# Altium schematic sheet Pipa PRD.SchDoc
size 840 x 594 mm; SheetNumber: 1; SheetTotal: 1
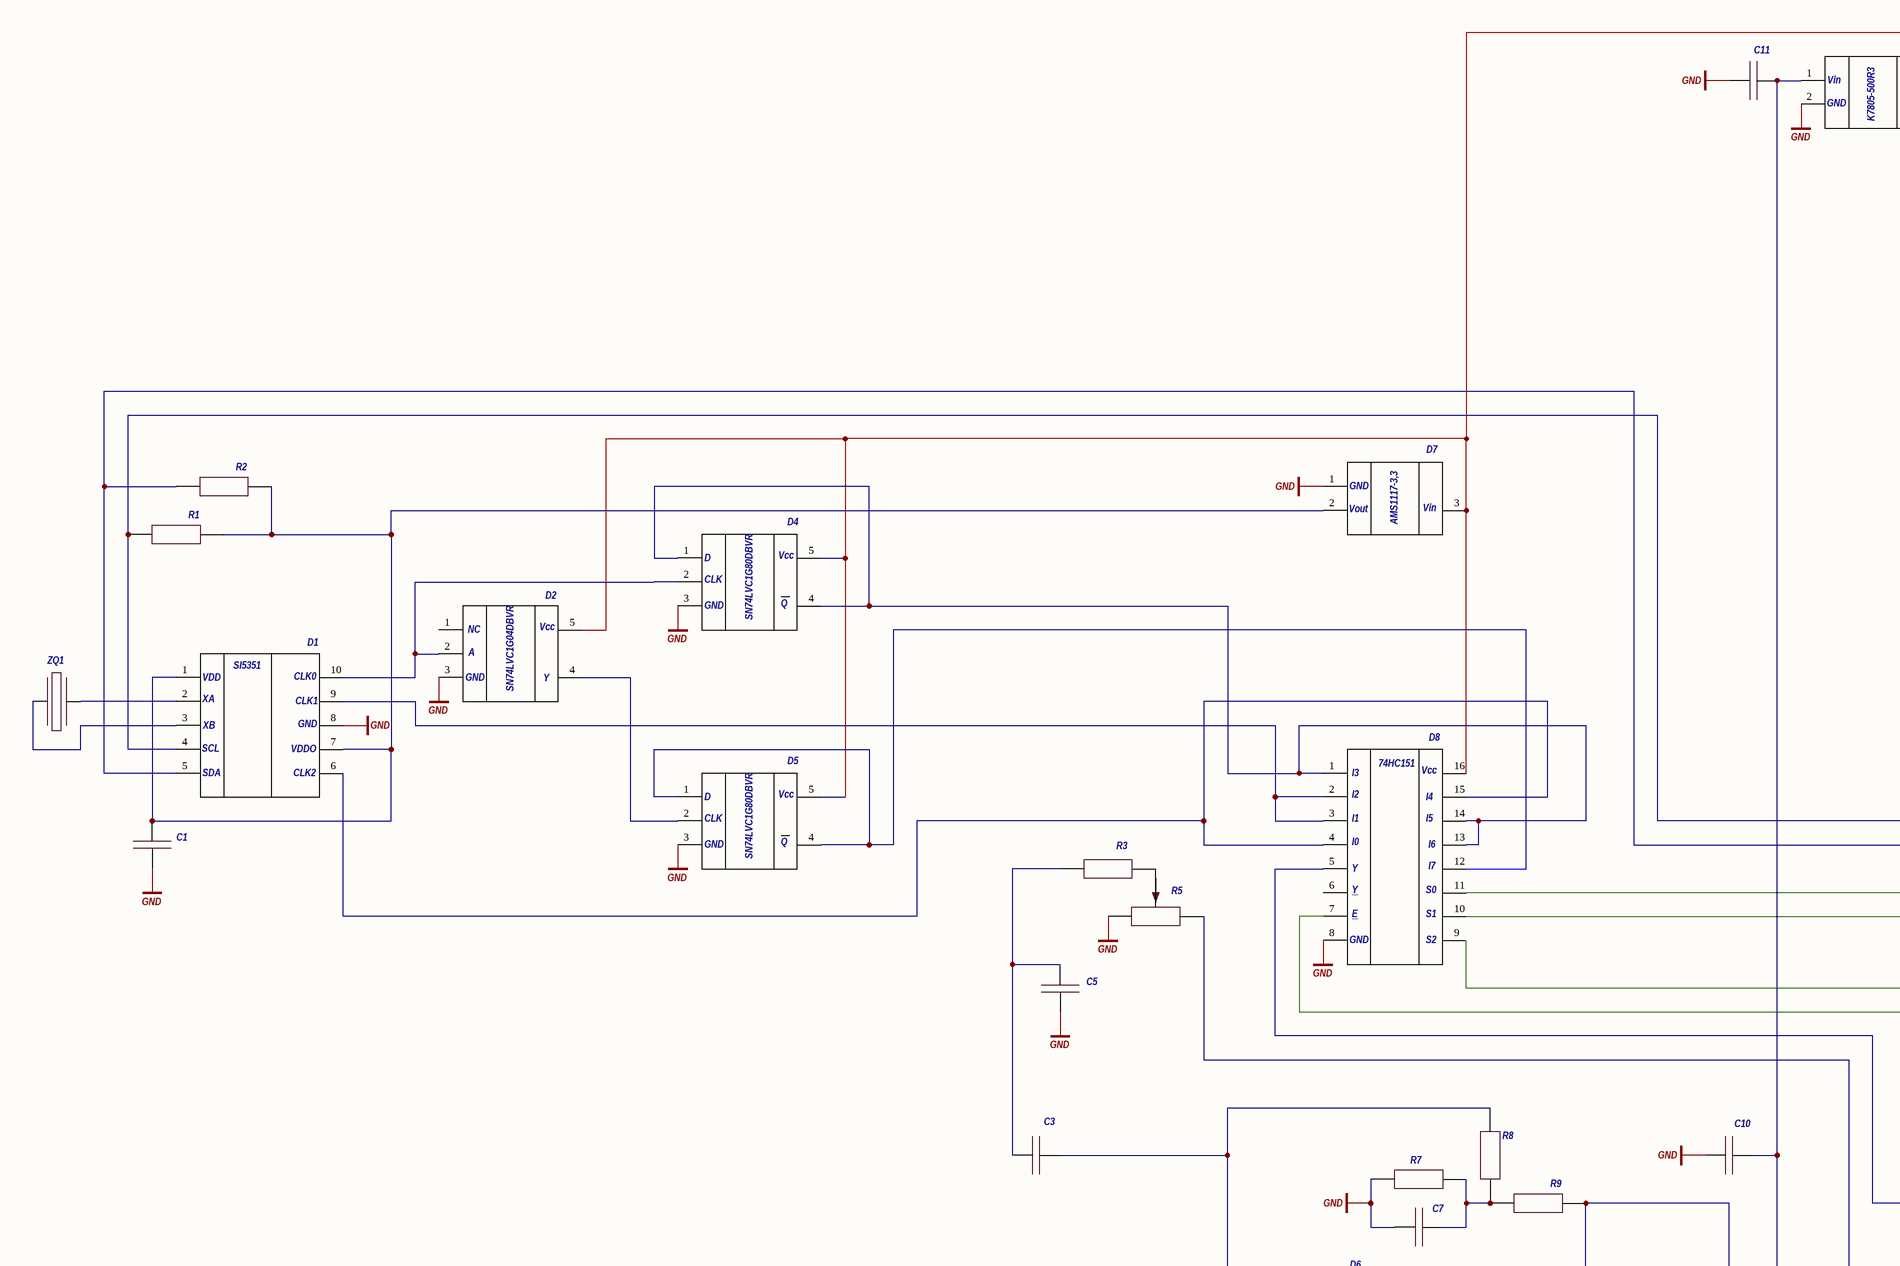
[diagram p0: Pipa PRD.SchDoc, top left]
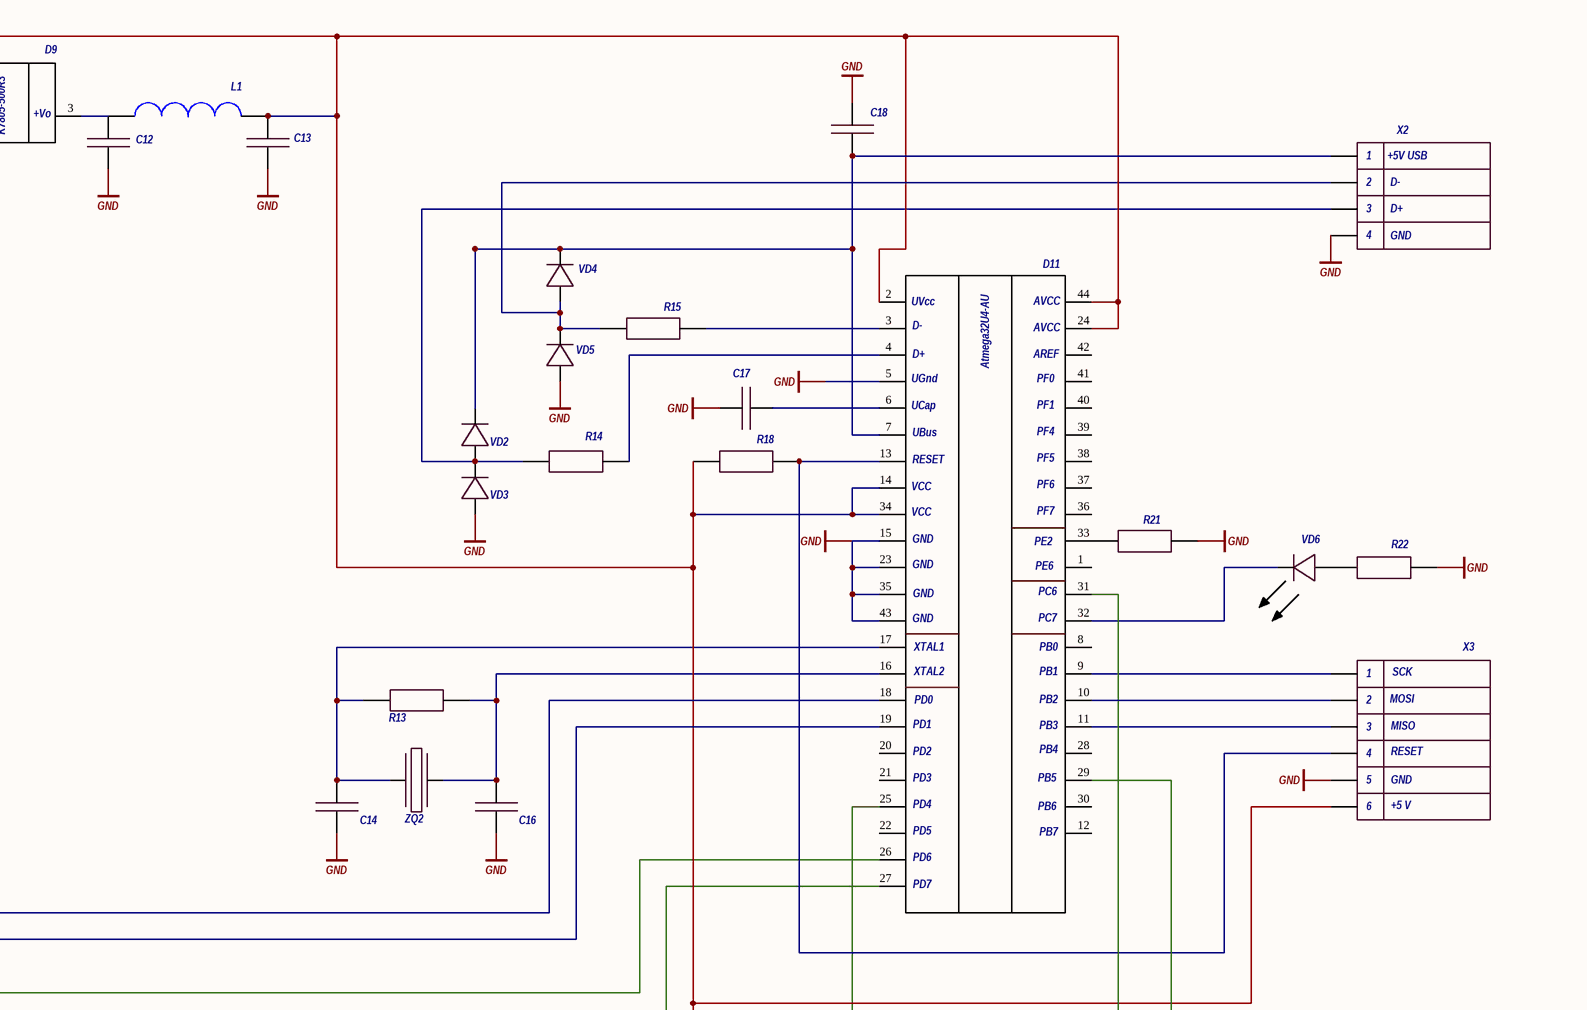
[diagram p1: Pipa PRD.SchDoc, top right]
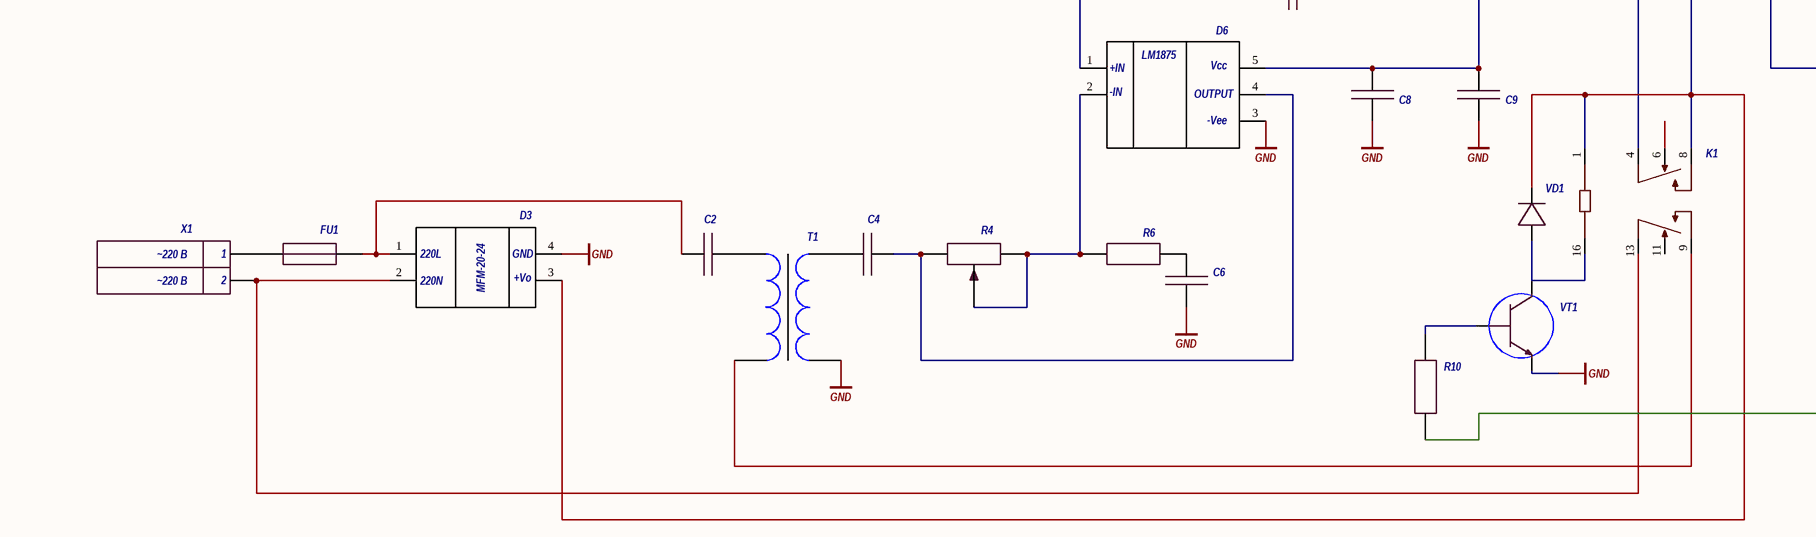
[diagram p2: Pipa PRD.SchDoc, bottom left]
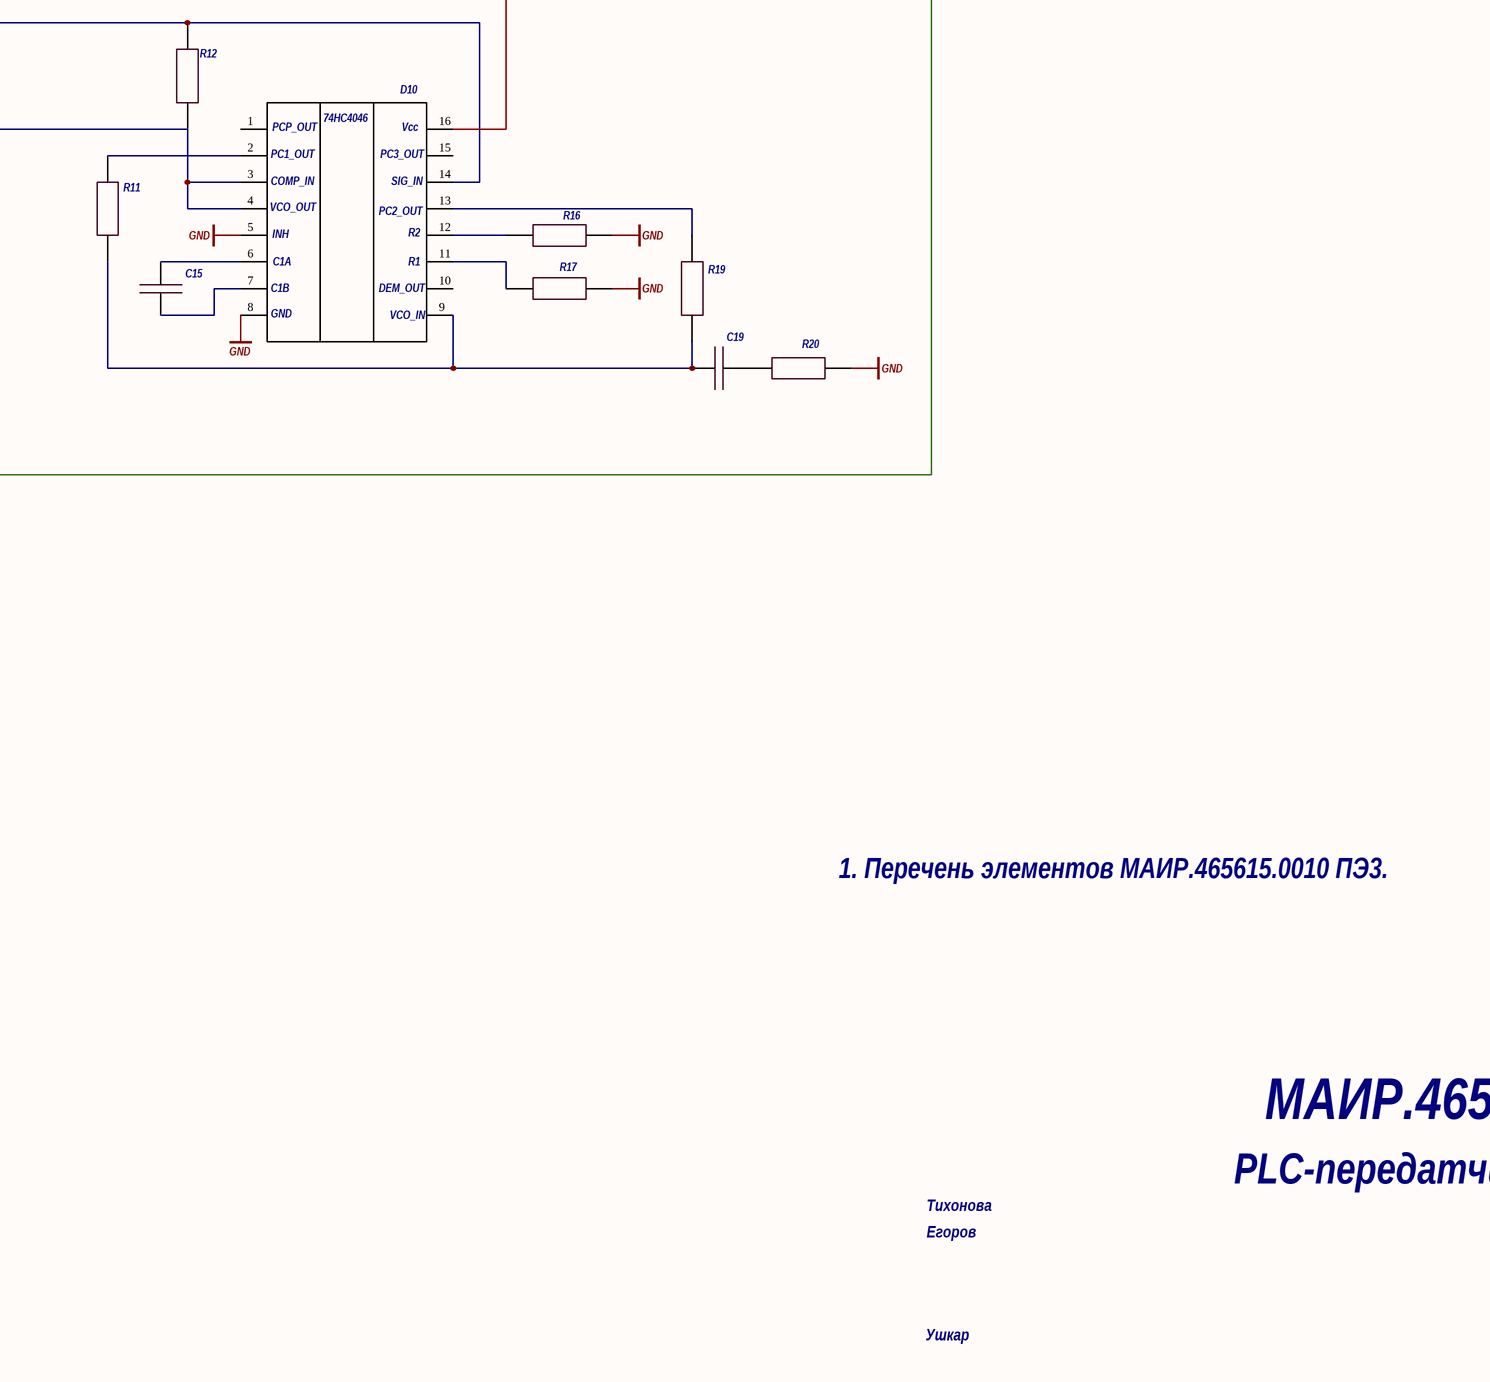
[diagram p3: Pipa PRD.SchDoc, bottom right]

## Parts
C1  Конденсатор  [С_0805]  (value not drawn)
C2  Конденсатор  [C_К73-17 24x11x24]  (value not drawn)
C3  22 мкФ  [С_0805]  (value not drawn)
C4  Конденсатор  [С_0805]  (value not drawn)
C5  Конденсатор  [С_0805]  (value not drawn)
C6  Конденсатор  [С_0805]  (value not drawn)
C7  Конденсатор  [С_0805]  (value not drawn)
C8  Конденсатор  [С_0805]  (value not drawn)
C9  Конденсатор  [C_К50-35 8x16]  (value not drawn)
C10  Конденсатор  [C_К50-35 8x16]  (value not drawn)
C11  Конденсатор  [С_0805]  (value not drawn)
C12  Конденсатор  [С_0805]  (value not drawn)
C13  Конденсатор  [C_1206]  (value not drawn)
C14  Конденсатор  [С_0805]  (value not drawn)
C15  Конденсатор  [С_0805]  (value not drawn)
C16  Конденсатор  [С_0805]  (value not drawn)
C17  Конденсатор  [С_0805]  (value not drawn)
C18  Конденсатор  [С_0805]  (value not drawn)
C19  Конденсатор  [С_0805]  (value not drawn)
D1  Микросхема SI5351  [MSOP-10]  (value not drawn)
D2  Микросхема SN74LVC1G04DBVR  [SOT-23-5 (3D)]  (value not drawn)
D3  MFM-20-24 преобразователь  [MFM-20-24 (3D)]  (value not drawn)
D4  Микросхема SN74LVC1G80DBVR  [SOT-23-5 (3D)]  (value not drawn)
D5  Микросхема SN74LVC1G80DBVR  [SOT-23-5 (3D)]  (value not drawn)
D6  Микросхема LM1875  [TO-220-5]  (value not drawn)
D7  Микросхема AMS1117-3,3  [SOT-223]  (value not drawn)
D8  Микросхема 74НС151  [SO16]  (value not drawn)
D9  Микросхема K7805-500R3  [K7805-500R3 (3D)]  (value not drawn)
D10  D  [SOIC-16 (3D)]  (value not drawn)
D11  Микросхема ATmega32U4-AU  [TQFP-44 (3D)]  (value not drawn)
FU1  Предохранитель  [FU_H520PT]  (value not drawn)
K1  Реле HJR1-2C  [HJR1-2C]  (value not drawn)
L1  Катушка индуктивности  [L_1812]  (value not drawn)
R1  Резистор  [R_0805]  (value not drawn)
R2  Резистор  [R_0805]  (value not drawn)
R3  Резистор  [R_0805]  (value not drawn)
R4  100 k  [3362P]  (value not drawn)
R5  1 кОм  [3362P]  (value not drawn)
R6  Резистор  [R_0805]  (value not drawn)
R7  Резистор  [R_0805]  (value not drawn)
R8  Резистор  [R_0805]  (value not drawn)
R9  Резистор  [R_0805]  (value not drawn)
R10  Резистор  [R_0805]  (value not drawn)
R11  Резистор  [R_0805]  (value not drawn)
R12  Резистор*  [R_0805]  (value not drawn)
R13  Резистор  [R_0805]  (value not drawn)
R14  Резистор  [R_0805]  (value not drawn)
R15  Резистор  [R_0805]  (value not drawn)
R16  Резистор  [R_0805]  (value not drawn)
R17  Резистор  [R_0805]  (value not drawn)
R18  Резистор  [R_0805]  (value not drawn)
R19  Резистор  [R_0805]  (value not drawn)
R20  Резистор  [R_0805]  (value not drawn)
R21  Резистор  [R_0805]  (value not drawn)
R22  Резистор  [R_0805]  (value not drawn)
T1  Трансформатор 4 вывода  [B82790]  (value not drawn)
VD1  Диод  [SOT-23-3 (3D)]  (value not drawn)
VD2  Диод  [SOD-323]  (value not drawn)
VD3  Диод  [SOD-323]  (value not drawn)
VD4  Диод  [SOD-323]  (value not drawn)
VD5  Диод  [SOD-323]  (value not drawn)
VD6  Светодиод  [VD_0805 SMD LED RED]  (value not drawn)
VT1  Транзистор n-p-n  [SOT-23-3 (3D)]  (value not drawn)
X1  Разъём 2 пин  [X_WJ126-5]  (value not drawn)
X2  Разъём 4 пин  [UCB-B (3D)]  (value not drawn)
X3  Разъём 6 пин  [X-PLS-6]  (value not drawn)
ZQ1  Резонатор  [HC33U]  (value not drawn)
ZQ2  Резонатор  [HC49S]  (value not drawn)

## Nets
GND: C1.2 C5.1 C6.1 C7.1 C8.2 C9.1 C10.2 C11.1 C12.1 C13.1 C14.1 C16.1 C17.2 C18.2 D1.8 D2.3 D3.4 D4.3 D5.3 D6.3 D7.1 D8.8 D9.2 D10.5 D10.8 D11.5 D11.15 D11.23 D11.35 D11.43 R5.1 R7.2 R16.2 R17.2 R20.1 R21.2 R22.2 T1.3 VD3.1 VD5.1 VT1.1 X2.4 X3.5
NetC1_1: C1.1 D1.1 D1.7 D7.2 R1.1 R2.1
NetC2_1: C2.1 T1.1
NetC2_2: C2.2 D3.1 FU1.2
NetC3_1: C3.1 D6.1 R8.2
NetC3_2: C3.2 C5.2 R3.2
NetC4_1: C4.1 T1.4
NetC4_2: C4.2 D6.4 R4.2
NetC6_2: C6.2 R6.2
NetC7_2: C7.2 R7.1 R8.1 R9.1
NetC8_1: C8.1 C9.2 D6.5 K1.4 R9.2
NetC10_1: C10.1 C11.2 D3.3 D9.1 K1.1 K1.8 VD1.2
NetC12_2: C12.2 D9.3 L1.1
NetC13_2: C13.2 D2.5 D4.5 D5.5 D7.3 D8.16 D10.16 D11.2 D11.14 D11.24 D11.34 D11.44 L1.2 R18.2 X3.6
NetC14_2: C14.2 D11.17 R13.1 ZQ2.1
NetC15_1: C15.1 D10.7
NetC15_2: C15.2 D10.6
NetC16_2: C16.2 D11.16 R13.2 ZQ2.2
NetC17_1: C17.1 D11.6
NetC18_1: C18.1 D11.7 VD2.2 VD4.2 X2.1
NetC19_1: C19.1 D10.9 R11.2 R19.1
NetC19_2: C19.2 R20.2
NetD1_2: D1.2 ZQ1.2
NetD1_3: D1.3 ZQ1.1
NetD1_4: D1.4 D11.18 R1.2
NetD1_5: D1.5 D11.19 R2.2
NetD1_6: D1.6 D8.4 D8.15
NetD1_9: D1.9 D8.2 D8.3
NetD1_10: D1.10 D2.2 D4.2
NetD2_4: D2.4 D5.2
NetD3_2: D3.2 K1.13 X1.2
NetD4_1: D4.1 D4.4 D8.1 D8.13 D8.14
NetD5_1: D5.1 D5.4 D8.12
NetD6_2: D6.2 R4.1 R4.3 R6.1
NetD8_5: D8.5 D10.14 R12.1
NetD8_7: D8.7 D11.25
NetD8_9: D8.9 D11.29
NetD8_10: D8.10 D11.27
NetD8_11: D8.11 D11.26
NetD10_2: D10.2 R11.1
NetD10_3: D10.3 D10.4 R5.2 R12.2
NetD10_11: D10.11 R17.1
NetD10_12: D10.12 R16.1
NetD10_13: D10.13 R19.2
NetD11_3: D11.3 R15.2
NetD11_4: D11.4 R14.2
NetD11_9: D11.9 X3.1
NetD11_10: D11.10 X3.2
NetD11_11: D11.11 X3.3
NetD11_13: D11.13 R18.1 X3.4
NetD11_31: D11.31 R10.2
NetD11_32: D11.32 VD6.2
NetD11_33: D11.33 R21.1
NetFU1_1: FU1.1 X1.1
NetK1_9: K1.9 T1.2
NetK1_16: K1.16 VD1.1 VT1.2
NetR3_1: R3.1 R5.3
NetR10_1: R10.1 VT1.3
NetR14_1: R14.1 VD2.1 VD3.2 X2.3
NetR15_1: R15.1 VD4.1 VD5.2 X2.2
NetR22_1: R22.1 VD6.1

Not connected (* = marked no-connect by the designer): D2 1; D8 6; D10 1 10 15; D11 1 8 12 20 21 22 28 30 36 37 38 39 40 41 42; K1 6 11

## Notes on the sheet
- (near X2) +5V USB
- (near X2) D-
- (near X2) D+
- (near X2) GND
- (near X3) SCK
- (near X3) MOSI
- (near X3) MISO
- (near X3) RESET
- (near X3) GND
- (near X3) +5 V
- (near X1) ~220 В
- 1. Перечень элементов МАИР.465615.0010 ПЭ3.
- МАИР.465615.0010 Э3
- PLC-передатчик
- Тихонова
- Егоров
- Ушкар
- Подп. и дата
- Инв. № дубл.
- Взам. инв. №
- Изм.
- Лист
- № докум.
- Подп.
- Дата
- Лит.
- Масса
- Масштаб
- Т.контр.
- Пров.
- Разраб.
- Схема электрическая
- принципиальная
- Листов
- 1
- Инв. № подл.
- Н.контр.
- Утв.
- Копировал
- Формат А1
- (in symbol MFM-20-24 преобразователь) 220L; GND; +Vo; 220N; MFM-20-24
- (in symbol Микросхема 74НС151) 74НС151; Vcc; I3; I2; I4; I1; I5; I0; I6; Y; I7; S0; E; S1; GND; S2
- (in symbol Микросхема 74НС4046) 74НС4046; PCP_OUT; Vcc; PC1_OUT; PC3_OUT; COMP_IN; SIG_IN; VCO_OUT; PC2_OUT; R2; INH; C1A; R1; C1B; DEM_OUT; GND; VCO_IN
- (in symbol Микросхема AMS1117-3,3) GND; Vout; Vin; AMS1117-3,3
- (in symbol Микросхема ATmega32U4-AU) UVcc; AVCC; D-; D+; AREF; Atmega32U4-AU; UGnd; PF0; UCap; PF1; UBus; PF4; RESET; PF5; VCC; PF6; PF7; GND; PE2; PE6; PC6; PC7; XTAL1; PB0; XTAL2; PB1; PD0; PB2; PD1; PB3; PD2; PB4; PD3; PB5; PD4; PB6; PD5; PB7; PD6; PD7
- (in symbol Микросхема K7805-500R3) Vin; GND; +Vo; K7805-500R3
- (in symbol Микросхема LM1875) LM1875; +IN; Vcc; -IN; OUTPUT; -Vee
- (in symbol Микросхема SI5351) SI5351; VDD; CLK0; XA; CLK1; GND; XB; SCL; VDDO; SDA; CLK2
- (in symbol Микросхема SN74LVC1G04DBVR) NC; Vcc; A; GND; Y; SN74LVC1G04DBVR
- (in symbol Микросхема SN74LVC1G80DBVR) D; Vcc; CLK; GND; Q; SN74LVC1G80DBVR

## Library data of the parts
C3 = Конденсатор
D10 = Микросхема 74НС4046
R4 = Потенциометр: Value: 100 k
R5 = Потенциометр: Value: 100 k
R12 = Резистор